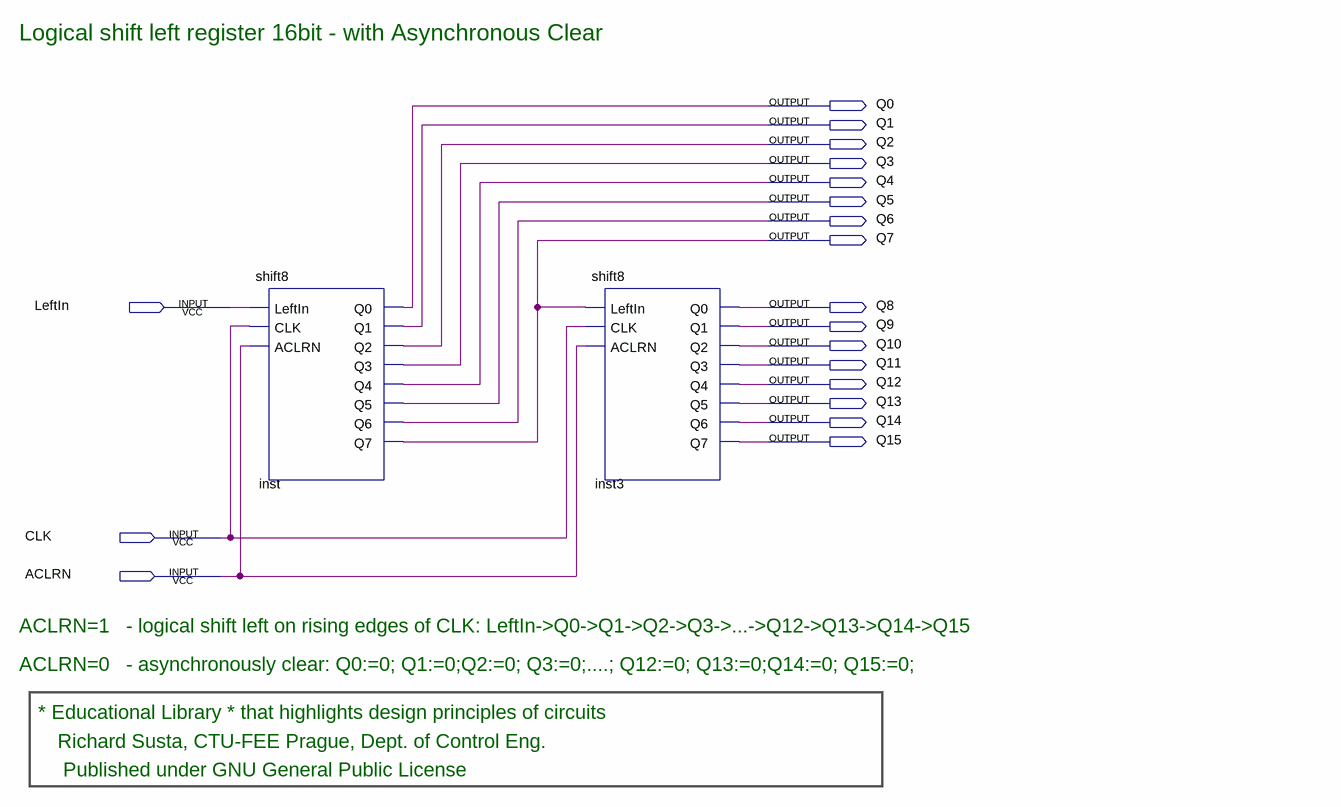
[diagram p0: schematic sheet]
// Quartus schematic shift16.bdf as structural Verilog: 2 symbols, 19 pins
module shift16 (
  input  LeftIn,
  input  CLK,
  input  ACLRN,
  output Q0,
  output Q1,
  output Q2,
  output Q3,
  output Q4,
  output Q5,
  output Q6,
  output Q7,
  output Q8,
  output Q9,
  output Q10,
  output Q11,
  output Q12,
  output Q13,
  output Q14,
  output Q15
);

  shift8 inst (
    .LeftIn(LeftIn), .CLK(CLK), .ACLRN(ACLRN), .Q0(Q0), .Q1(Q1), .Q2(Q2), .Q3(Q3), .Q4(Q4), .Q5(Q5), .Q6(Q6),
    .Q7(Q7));
  shift8 inst3 (
    .LeftIn(Q7), .CLK(CLK), .ACLRN(ACLRN), .Q0(Q8), .Q1(Q9), .Q2(Q10), .Q3(Q11), .Q4(Q12), .Q5(Q13),
    .Q6(Q14), .Q7(Q15));

  // Notes on the sheet:
  //   Logical shift left register 16bit - with Asynchronous Clear
  //   ACLRN=1   - logical shift left on rising edges of CLK: LeftIn->Q0->Q1->Q2->Q3->...->Q12->Q13->Q14->Q15
  //   ACLRN=0   - asynchronously clear: Q0:=0; Q1:=0;Q2:=0; Q3:=0;....; Q12:=0; Q13:=0;Q14:=0; Q15:=0;
  //   * Educational Library * that highlights design principles of circuits
  //   Richard Susta, CTU-FEE Prague, Dept. of Control Eng. 
  //    Published under GNU General Public License
endmodule
